# Altium schematic sheet Intel_CPLD.SchDoc
size A4; SheetNumber: 2; SheetTotal: 3
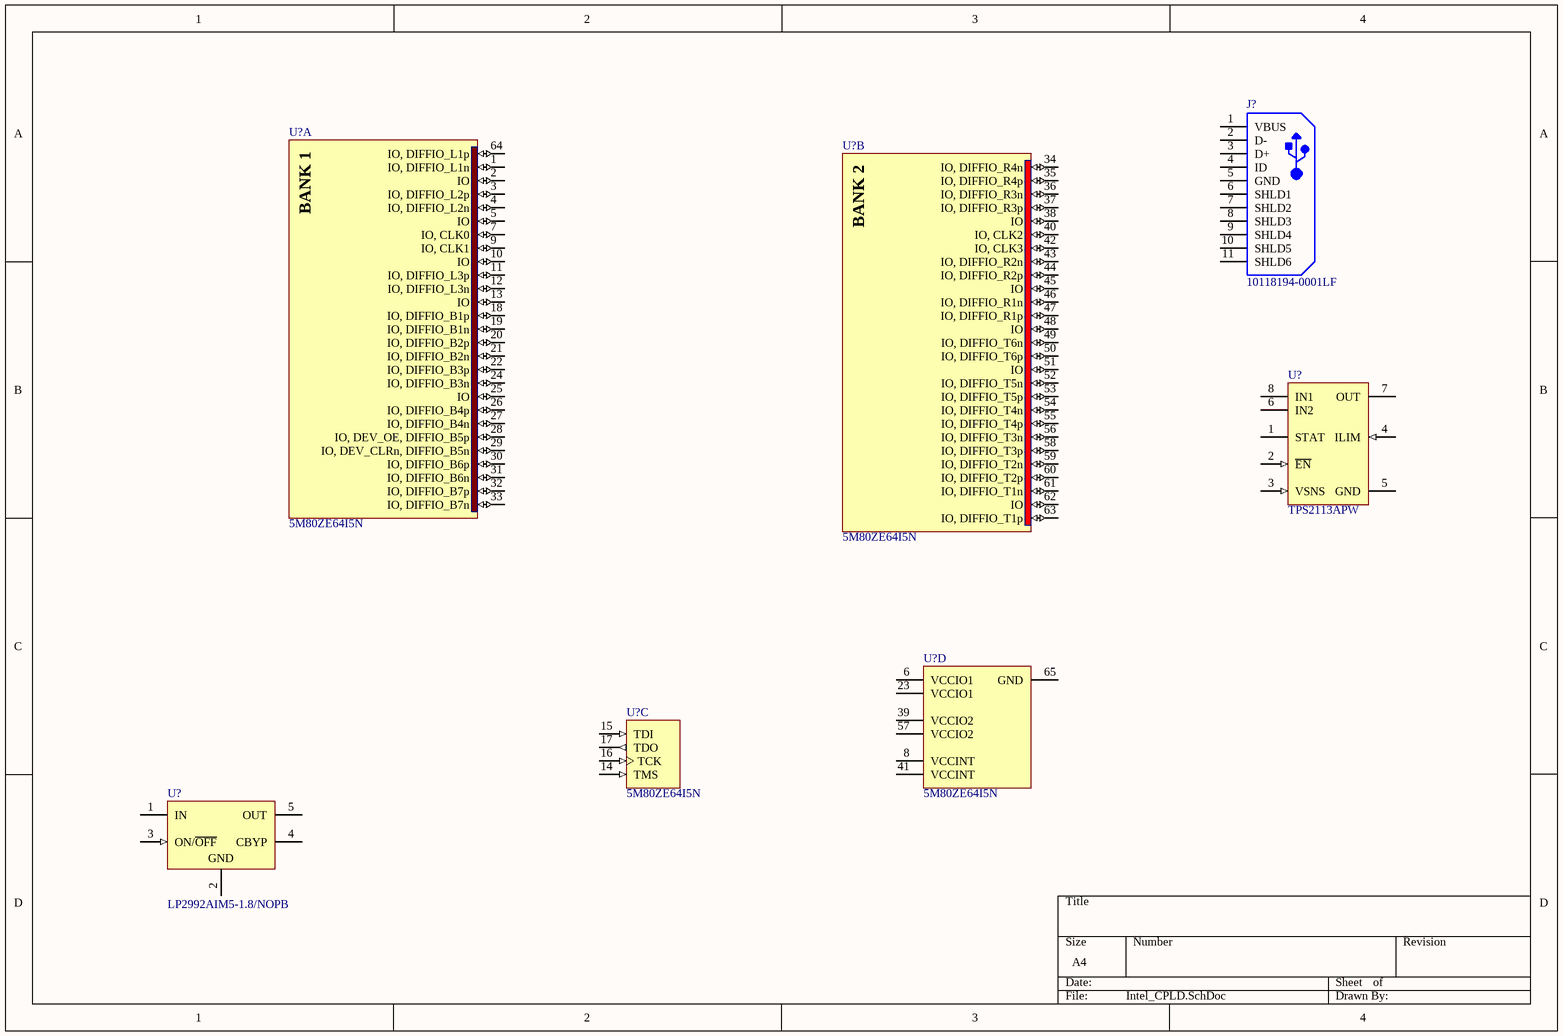
[diagram p0: Intel_CPLD.SchDoc]

## Parts
(Parts that share a designator on the sheet are numbered #1, #2 ... from top to bottom, then left to right.)
J?  10118194-0001LF  [FCI-10118194-0001LF-5_V]
U?#1  5M80ZE64I5N  [EQFP64_A-120_D2-45_M]  (part A of 4)
U?#2  5M80ZE64I5N  [EQFP64_A-120_D2-45_M]  (part B of 4)
U?#3  TPS2113APW  [PW0008A_N]
U?#4  5M80ZE64I5N  [EQFP64_A-120_D2-45_M]  (part D of 4)
U?#5  5M80ZE64I5N  [EQFP64_A-120_D2-45_M]  (part C of 4)
U?#6  LP2992AIM5-1.8/NOPB  [MF05A_N]

## Nets

Not connected (* = marked no-connect by the designer): J? 1(VBUS) 2(D-) 3(D+) 4(ID) 5(GND) 6(SHLD1) 7(SHLD2) 8(SHLD3) 9(SHLD4) 10(SHLD5) 11(SHLD6); U?#1 1(IO,_DIFFIO_L1n) 2(IO) 3(IO,_DIFFIO_L2p) 4(IO,_DIFFIO_L2n) 5(IO) 7(IO,_CLK0) 9(IO,_CLK1) 10(IO) 11(IO,_DIFFIO_L3p) 12(IO,_DIFFIO_L3n) 13(IO) 18(IO,_DIFFIO_B1p) 19(IO,_DIFFIO_B1n) 20(IO,_DIFFIO_B2p) 21(IO,_DIFFIO_B2n) 22(IO,_DIFFIO_B3p) 24(IO,_DIFFIO_B3n) 25(IO) 26(IO,_DIFFIO_B4p) 27(IO,_DIFFIO_B4n) 28(IO,_DEV_OE,_DIFFIO_B5p) 29(IO,_DEV_CLRn,_DIFFIO_B5n) 30(IO,_DIFFIO_B6p) 31(IO,_DIFFIO_B6n) 32(IO,_DIFFIO_B7p) 33(IO,_DIFFIO_B7n) 64(IO,_DIFFIO_L1p); U?#2 34(IO,_DIFFIO_R4n) 35(IO,_DIFFIO_R4p) 36(IO,_DIFFIO_R3n) 37(IO,_DIFFIO_R3p) 38(IO) 40(IO,_CLK2) 42(IO,_CLK3) 43(IO,_DIFFIO_R2n) 44(IO,_DIFFIO_R2p) 45(IO) 46(IO,_DIFFIO_R1n) 47(IO,_DIFFIO_R1p) 48(IO) 49(IO,_DIFFIO_T6n) 50(IO,_DIFFIO_T6p) 51(IO) 52(IO,_DIFFIO_T5n) 53(IO,_DIFFIO_T5p) 54(IO,_DIFFIO_T4n) 55(IO,_DIFFIO_T4p) 56(IO,_DIFFIO_T3n) 58(IO,_DIFFIO_T3p) 59(IO,_DIFFIO_T2n) 60(IO,_DIFFIO_T2p) 61(IO,_DIFFIO_T1n) 62(IO) 63(IO,_DIFFIO_T1p); U?#3 1(STAT) 2(~{EN}) 3(VSNS) 4(ILIM) 5(GND) 6(IN2) 7(OUT) 8(IN1); U?#4 6(VCCIO1) 8(VCCINT) 23(VCCIO1) 39(VCCIO2) 41(VCCINT) 57(VCCIO2) 65(GND); U?#5 14(TMS) 15(TDI) 16(TCK) 17(TDO); U?#6 1(IN) 2(GND) 3(ON/~{OFF}) 4(CBYP) 5(OUT)

## Notes on the sheet
- (in symbol CMP-0217-00123-1, part A) BANK 1
- (in symbol CMP-0217-00123-1, part B) BANK 2

## Library data of the parts
J? = CMP-2000-05120-1: Micro USB B Type Receptacle, 1.8 A, -55 to 85 degC, 5-Pin SMD, RoHS, Tape and Reel; Manufacturer: Amphenol FCI; Body Orientation: RightAngle; Number of Contacts: 5; Pitch: 0.65mm; Gender: RCP; Rad Hard: No; Package Reference: 10118194-0001LF-5; Mounting: SurfaceMount; Manufacturer URL: http://www.fci.com/; Packaging: CutTape; Datasheet URL: https://datasheet.ciiva.com/26945/getdatasheetpartid-418619-26945695.pdf; Termination Method: Solder; Package Description: 5-Pin Surface Mount Device, Body 8.05 x 5.53 mm, Pitch 0.65 mm; Type: MicroUSBTypeB; Datasheet Version: Rev. A, 10/2011
U?#1 U?#2 U?#4 U?#5 = CMP-0217-00123-1: MAX V 1.8V CPLD, 54 IOs, 80 Logic Elements, 64-Pin EQFP, Industrial Temperature, Speed Grade 5, Pb-Free; ComponentLink2URL: http://www.altera.com/literature/hb/max-v/max5_handbook.pdf; ComponentLink4Description: Package Specification; ComponentLink1URL: http://www.altera.com/; ComponentLink1Description: Manufacturer URL; ComponentLink2Description: Datasheet; DatasheetVersion: ver1.2, May-2011; ComponentLink3URL: http://www.altera.com/literature/lit-dp.jsp?category=MAX%205&showspreadsheet=y; ComponentLink4URL: http://www.altera.com/devicepackaging/04R00384-01.pdf; Code_JEDEC: MS-026-ABD-HD; PackageVersion: ver1.0, Jul-2011; PackageDescription: 64-Pin Plastic Enhanced Quad Flat (EQFP) - Wire Bond - A:1.20 - D2:4.5; ComponentLink3Description: MAX V Device Pin-Out files; PackageReference: EQFP64_A-120_D2-45
U?#3 = CMP-0339-00043-2: Dual In / Single Out Autoswitching Power Mux, 2.8 to 5.5 V, -40 to 85 degC, 8-pin TSSOP (PW), Green (RoHS & no Sb/Br); Manufacturer: Texas Instruments; IN2 Output Current(Max)(A): 1.25; SubFamily: Power Multiplexer (MUX); IN2 rDS(on)(Typ)(Ohms): 0.084; IN1, IN2 Input Voltage(Min)(V): 2.8; IN1 rDS(on)(Typ)(mOhm): 84; IN1, IN2 Input Voltage(Max)(V): 5.5; Number of Inputs: 2; Mounting Technology: Surface Mount; Code_JEDEC: MO-153; IN1 Output Current(Max)(A): 1.25; DatasheetVersion: SBVS045C; ComponentLink1Description: Datasheet; PackageVersion: revG, Feb-2011; Eco-Plan: Green (RoHS & no Sb/Br); ComponentLink1URL: http://www.ti.com/general/docs/lit/getliterature.tsp?genericPartNumber=TPS2113A&fileType=pdf; PackageDescription: 8-Pin Plastic Thin Small Outline Package 3 x 4.4 mm Body ,0.65 mm Pitch; PackageReference: PW0008A; PartNumber: TPS2113APW
U?#6 = CMP-0062-02117-2: Micropower 250 mA Low-Noise Ultra Low-Dropout Regulator, 5-pin SOT-23, Pb-Free; Manufacturer: National Semiconductor; PowerWise: N; PackageTopMarking: LFCA*XTT; CompType: LDO IC; ComponentLink1URL: http://www.national.com/ds/LP/LP2992.pdf; PinCount: 5; PackageReference: MF05A; PackageVersion: revD, Aug-2008; ComponentLink3URL: http://www.national.com/packaging/folders/mf05a.html; DatasheetVersion: May-2005; ComponentLink2URL: http://www.national.com/pf/LP/LP2992.html; RevisionNote: Component URLs added; ComponentLink2Description: LP2992 Web Page; ComponentLink1Description: LP2992 Datasheet; RoHS: Y; PackageDescription: Molded SOT-23, .115 x .063 x .040 in Body, 5 Lead, .0375 in Pitch; ComponentLink3Description: MF05A Package Page